# EasyEDA Pro project custom_ctrl_20250401.epro, board PCB1
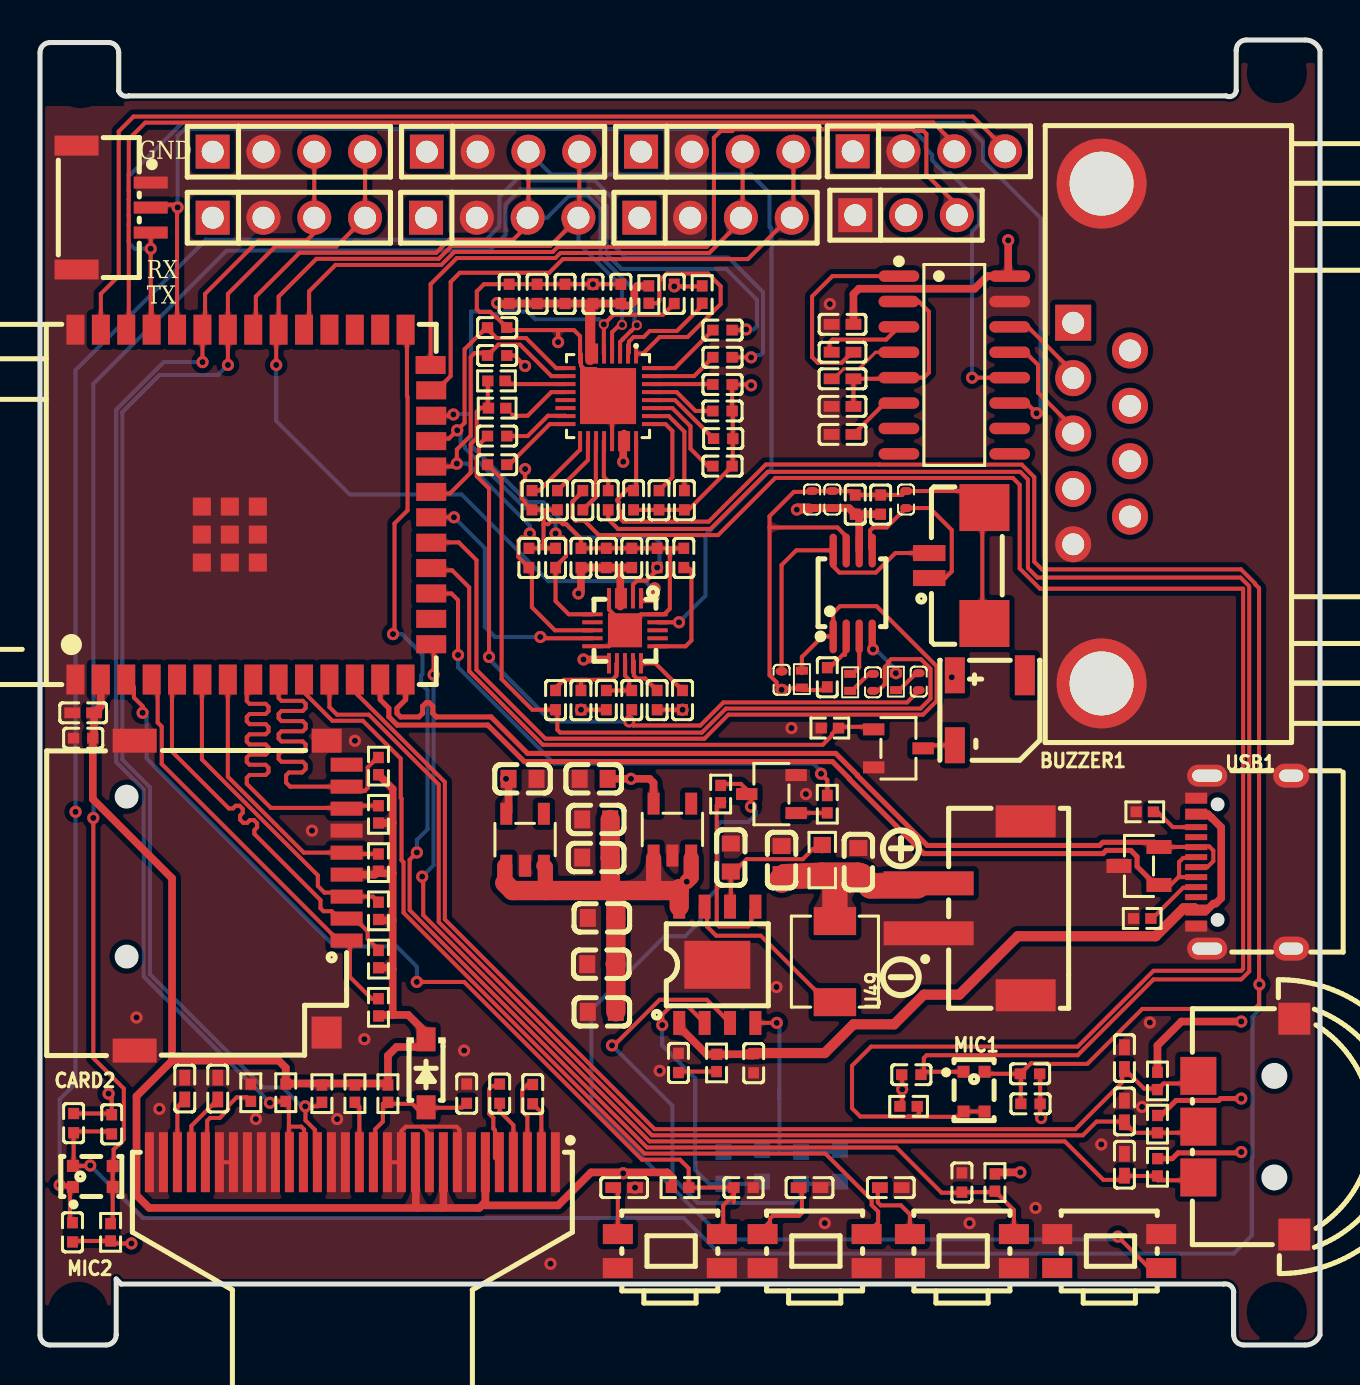
[diagram p1: board, top side]
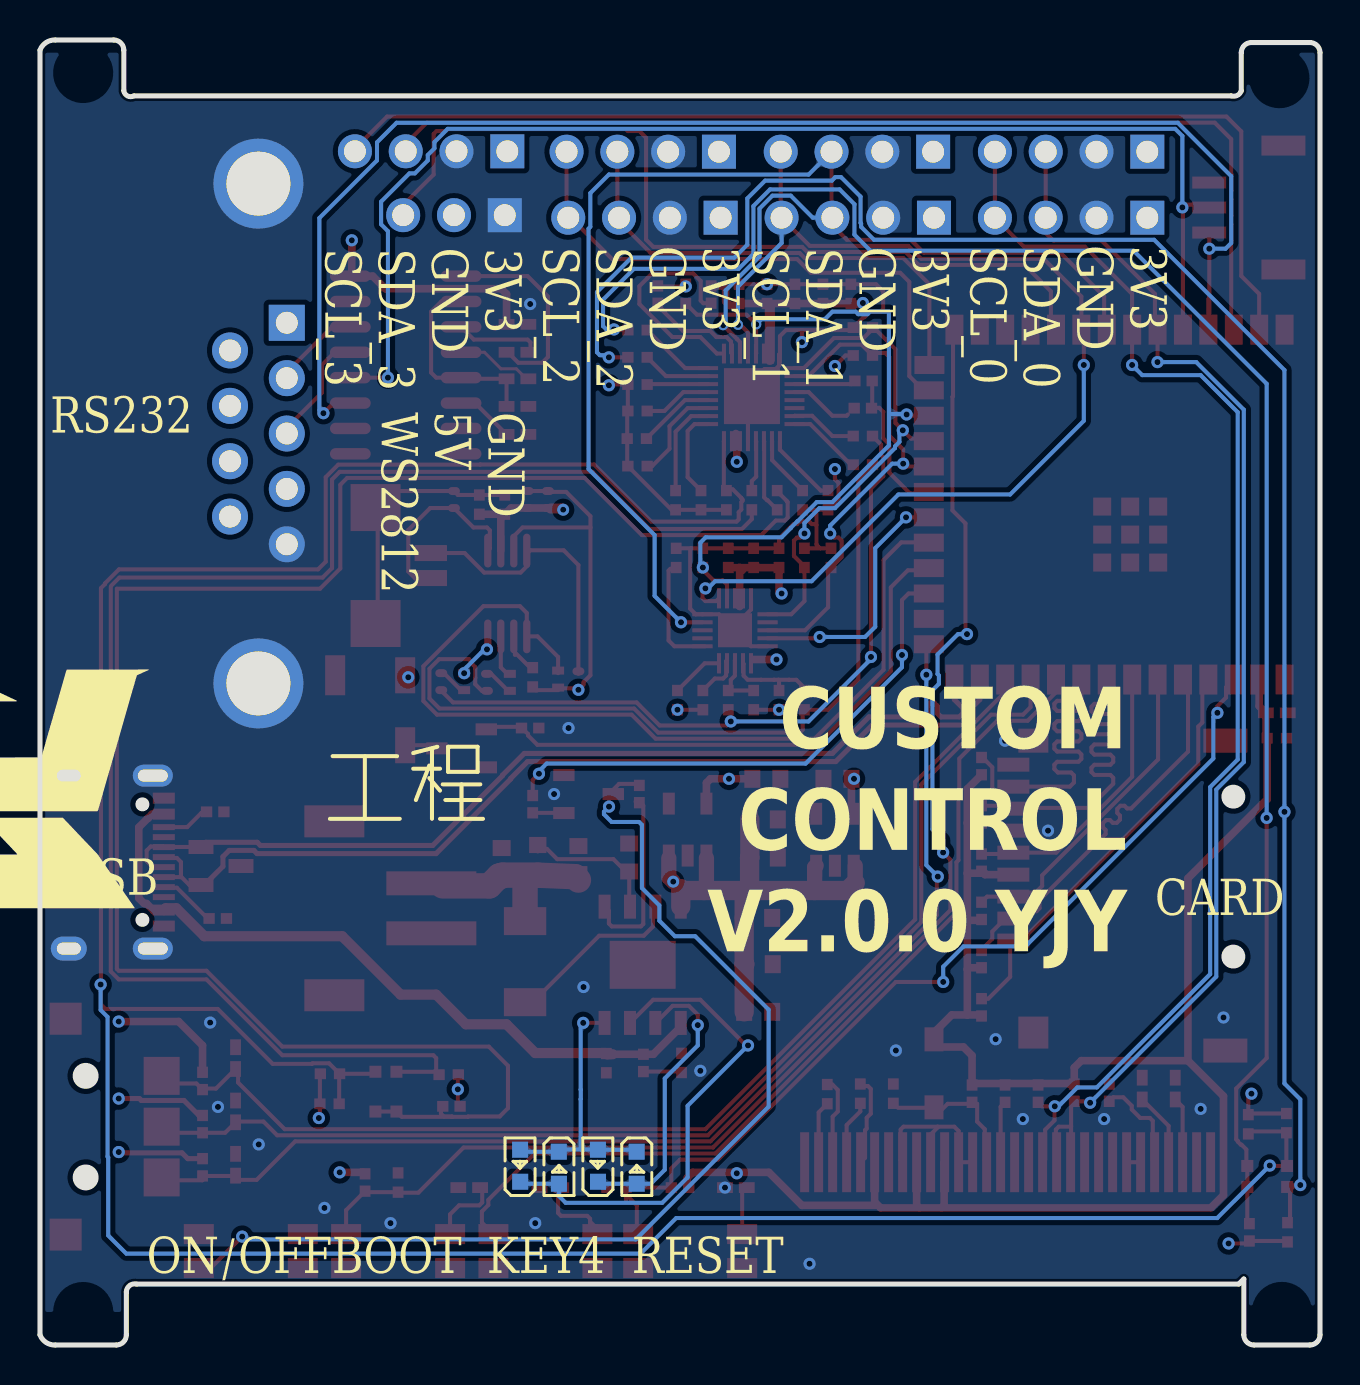
[diagram p2: board, bottom side, seen from below]

Outline 64.01 x 65.28 mm; copper layers: Top Layer, 电源层, 地层, Bottom Layer. Coordinates in mm from the lower left corner of the outline.
Outline path: 0,64.64 arc(0.15,65) 0.51,65.15 3.43,65.15 arc(3.79,65) 3.94,64.64 3.94,62.74 arc(4.14,62.51) 4.45,62.48 59.31,62.48 arc(59.63,62.48) 59.82,62.74 59.82,64.77 arc(59.97,65.13) 60.32,65.28 63.25,65.28 arc(63.71,65.15) 64.01,64.77 64.01,0.51 arc(63.71,0.13) 63.25,0 60.2,0 arc(59.84,0.15) 59.69,0.51 59.69,2.67 arc(59.53,2.98) 59.18,3.05 4.06,3.05 3.81,3.3 3.81,0.51 arc(3.66,0.15) 3.3,0 0.51,0 arc(0.15,0.15) 0,0.51 0,64.64
Stack: Top Layer 0.035mm 外层铜厚1oz / Dielectric1 0.2104mm 7628 RC49% 8.6mil / 电源层 0.0152mm 内层铜厚 / Dielectric2 1.065mm 1.1mm H/HOZ Copper / 地层 0.0152mm 内层铜厚 / Dielectric3 0.2104mm 7628 RC49% 8.6mil / Bottom Layer 0.035mm 外层铜厚1oz

## Design rules (mm)
net D-: DP1
net D+: DP1
template: 自定义配置
spacing copperThickness1oz (default): track to track 0.102, other pairs 0.152 to 0.3
spacing copperThickness2oz: track to track 0.203, other pairs 0.152 to 0.3
track width copperThickness1oz (default): min 0.127, default 0.203, max 2.54
track width copperThickness2oz: min 0.203, default 0.254, max 2.54
track width 3V3: min 0.127, default 0.381, max 2.54
track width vbus: min 0.127, default 1.27, max 2.54
track width 5V: min 0.127, default 0.965, max 2.54
differential pair differentialPair (default): width min 0.127, default 0.254, max 2.54; gap min 0.152, default 0.152
via viaSize (default): diameter min 0.5, default 0.61, max 10; hole min 0.3, default 0.305, max 6.299
net +5V uses 5V
net VBUS uses 3V3
net VBAT uses vbus
net 3V3 uses 3V3
net VDD_3V3 uses 3V3

## Placement (name value [footprint] x y rotation side)
BUZZER1  FST-5020  [BUZ-SMD_FST-5020]  47.5 31.75 270 top
C1  22uF  [C0603]  28.1 16.66 180 top
C2  22uF  [C0603]  28.07 19.05 180 top
C3  22uF  [C0603]  28.1 21.36 180 top
C4  10uF  [C0402]  35.69 14.1 90 top
C5  22uF  [C0603]  37.08 24.26 270 top
C6  22uF  [C0603]  40.92 24.16 270 top
C7  10uF  [C0402]  31.93 14.11 270 top
C8  22uF  [C0603]  34.54 24.38 270 top
C13  22uF  [C0603]  27.81 26.29 0 top
C14  22uF  [C0603]  27.69 28.32 0 top
C15  100nF  [C0402#2]  41.66 33.15 270 top
C16  1uF  [C0402]  39.37 33.4 270 top
C17  1uF  [C0402]  40.77 42.04 90 top
C18  1nF  [C0402#2]  38.61 42.29 270 top
C19  100nF  [C0402#2]  39.62 42.29 270 top
C20  10uF  [C0402]  42.04 42.04 270 top
C21  1nF  [C0402#2]  43.31 42.29 270 top
C22  1nF  [C0402#2]  37.08 33.27 270 top
C34  100nF  [C0402#3]  54.23 14.35 270 top
C35  100nF  [C0402#3]  54.23 11.68 270 top
C36  100nF  [C0402#3]  54.23 9.02 270 top
C37  1uF  [C0402]  34.16 45.34 0 top
C39  1uF  [C0402]  34.13 43.96 0 top
C40  1uF  [C0402]  32.22 42.26 270 top
C41  1uF  [C0402]  30.95 42.26 270 top
C42  1uF  [C0402]  32.19 39.37 270 top
C43  1uF  [C0402]  29.68 42.26 270 top
C44  1uF  [C0402]  32.13 32.26 90 top
C45  1uF  [C0402]  30.86 32.26 90 top
C46  1uF  [C0402]  24.64 12.55 270 top
C47  1uF  [C0402]  22.99 12.57 270 top
C48  4.7uF  [C0402#3]  7.24 12.83 270 top
C49  4.7uF  [C0402#3]  8.89 12.83 270 top
C50  10uF  [C0402]  21.34 12.57 270 top
C51  220nF  [C0402#3]  40.13 49.66 0 top
C56  10uF  [C0402]  2.16 30.35 0 top
C57  100nF  [C0402#3]  2.16 31.62 0 top
C58  1uF  [C0402]  28.41 42.26 90 top
C59  1uF  [C0402]  24.6 42.26 270 top
C60  1uF  [C0402]  25.87 42.26 270 top
C61  1uF  [C0402]  27.14 42.26 270 top
C62  22pF  [C0402]  30.86 39.37 270 top
C63  22pF  [C0402]  25.78 39.37 270 top
C64  22pF  [C0402]  24.45 39.37 270 top
C65  1uF  [C0402]  35.18 7.87 180 top
C66  1uF  [C0402]  46.1 8.13 270 top
C67  100nF  [C0402#3]  42.55 7.87 180 top
C68  100nF  [C0402#3]  29.21 7.87 180 top
C69  100nF  [C0402#3]  38.48 7.87 180 top
C78  100nF  [C0402#2]  43.94 33.18 270 top
C79  1uF  [C0402]  29.05 52.58 270 top
C80  100nF  [C0402]  26.25 52.58 270 top
C81  100nF  [C0402]  27.65 52.58 270 top
C82  22pF  [C0402]  31.72 52.58 270 top
C83  22pF  [C0402]  22.86 50.89 180 top
C84  22pF  [C0402]  22.86 49.5 180 top
C85  1uF  [C0402]  22.86 44.03 0 top
C86  1uF  [C0402]  22.86 45.47 0 top
C87  1uF  [C0402]  24.86 52.58 90 top
C88  1uF  [C0402]  23.46 52.58 90 top
C89  1uF  [C0402]  34.13 48.04 0 top
C90  1uF  [C0402]  34.13 46.72 0 top
C91  22uF  [C0603]  24.13 28.32 180 top
C92  22uF  [C0603]  27.81 24.38 0 top
C95  1uF  [C0402]  34.13 50.77 180 top
C96  1uF  [C0402]  34.13 49.41 180 top
C97  100nF  [C0402]  1.68 11.1 90 top
C98  10uF  [C0402]  3.59 11.04 270 top
C99  22pF  [C0402]  1.62 5.64 90 top
C100  22pF  [C0402]  43.57 13.52 0 top
C101  10uF  [C0402]  49.53 12.06 180 top
C102  100nF  [C0402]  49.51 13.57 0 top
C103  100nF  [C0402]  29.59 39.37 270 top
C104  100nF  [C0402]  28.32 39.37 270 top
C105  1uF  [C0402]  27.05 39.37 270 top
C106  22pF  [C0402]  27.05 32.26 90 top
C107  22pF  [C0402]  28.32 32.26 90 top
C108  1uF  [C0402]  25.78 32.26 90 top
C109  1uF  [C0402]  29.59 32.26 90 top
C113  220nF  [C0402#3]  40.13 48.33 0 top
C114  220nF  [C0402#3]  40.13 46.95 0 top
C115  220nF  [C0402#3]  40.13 45.55 0 top
C116  220nF  [C0402#3]  40.13 51.05 0 top
CARD2  TF PUSH  [TF-SMD_TF-PUSH]  10.03 22.48 270 top
D2  1N4148W  [SOD-123_L2.7-W1.6-LS3.7-RD-1]  19.3 13.59 270 top
D25  25%  [LED_0603]  34.16 8.82 270 bottom
D50  50%  [LED_0603]  36.11 9.02 90 bottom
D75  75%  [LED_0603]  38.05 8.82 270 bottom
D100  100%  [LED_0603]  40 9.02 90 bottom
FPC1  HC-1.25-2PLT  [CONN-SMD_HC-1.25-2PLT]  45.85 38.99 90 top
H1  PZ254V-11-04P  [HDR-TH_4P-P2.54-V-M]  12.45 59.69 0 top
H2  PZ254V-11-04P  [HDR-TH_4P-P2.54-V-M]  12.45 56.39 0 top
H5  PZ254V-11-03P  [HDR-TH_3P-P2.54-V-M]  43.31 56.51 0 top
H6  PZ254V-11-04P  [HDR-TH_4P-P2.54-V-M]  23.11 56.39 0 top
H7  PZ254V-11-04P  [HDR-TH_4P-P2.54-V-M]  23.16 59.69 0 top
H8  PZ254V-11-04P  [HDR-TH_4P-P2.54-V-M]  33.87 59.69 0 top
H9  PZ254V-11-04P  [HDR-TH_4P-P2.54-V-M]  33.78 56.39 0 top
H10  PZ254V-11-04P  [HDR-TH_4P-P2.54-V-M]  44.45 59.71 0 top
L1  1uH  [IND-SMD_L4.4-W4.2]  39.75 19.18 270 top
MIC1  ZTS6216  [MIC-SMD_4P-L2.8-W1.9-P1.84-TL]  46.71 12.67 0 top
MIC2  ZTS6216  [MIC-SMD_4P-L2.8-W1.9-P1.84-TL]  2.64 8.43 90 top
Q1  S8050  [SOT-23-3_L2.9-W1.6-P1.90-LS2.8-BR]  36.58 27.56 0 top
Q5  AO3400A  [SOT-23-3_L2.9-W1.6-P1.90-LS2.8-BR]  42.93 29.84 180 top
R1  2Ω  [R0402]  33.83 14.11 90 top
R2  10kΩ  [R0402]  34.04 27.56 90 top
R3  500mΩ  [R0603]  39.12 24.26 270 top
R5  1kΩ  [R0402]  39.37 27.05 270 top
R8  100kΩ  [R0402#2]  42.8 33.18 90 top
R9  100kΩ  [R0402#2]  40.51 33.15 90 top
R18  10kΩ  [R0402]  55.88 13.21 90 top
R19  10kΩ  [R0402]  55.88 11.05 90 top
R20  10kΩ  [R0402]  55.88 8.89 90 top
R26  10kΩ  [R0402]  30.45 52.54 90 top
R27  10kΩ  [R0402]  33.11 52.54 90 top
R30  620kΩ  [R0402]  10.54 12.62 270 top
R31  4.7kΩ  [R0402]  14.1 12.57 270 top
R32  4.7kΩ  [R0402]  12.29 12.62 90 top
R33  4.7kΩ  [R0402]  17.4 12.57 90 top
R34  4.7kΩ  [R0402]  15.75 12.57 90 top
R36  51Ω  [R0402]  22.83 48.23 0 top
R37  0Ω(NC)  [R0402]  22.86 46.86 0 top
R48  0Ω  [R0402]  3.53 5.64 90 top
R52  0Ω  [R0402]  43.43 11.94 0 top
R65  1kΩ  [R0402]  39.5 30.86 180 top
R72  100kΩ  [R0402#2]  38.1 33.31 90 top
R75  5.1kΩ  [R0402]  55.25 26.67 180 top
R76  5.1kΩ  [R0402]  55.12 21.34 180 top
R77  5.1kΩ  [R0402]  32 7.87 180 top
R78  5.1kΩ  [R0402]  47.75 8.13 90 top
R79  47K  [R0402]  16.93 16.89 90 top
R80  47K  [R0402]  16.93 19.3 90 top
R81  47K  [R0402]  16.93 21.72 90 top
R82  47K  [R0402]  16.93 24.13 90 top
R83  47K  [R0402]  16.93 26.54 90 top
R84  47K  [R0402]  16.93 28.96 90 top
SW2  K1-1502SA-01  [KEY-SMD_K1-1502SA-01]  60.32 10.92 270 top
SW7  TS-1085SA-B3  [KEY-SMD_4P-L4.8-W4.6-P1.70-LS6.2-1]  46.1 4.7 0 top
SW8  TS-1085SA-B3  [KEY-SMD_4P-L4.8-W4.6-P1.70-LS6.2-1]  31.5 4.7 0 top
SW9  TS-1085SA-B3  [KEY-SMD_4P-L4.8-W4.6-P1.70-LS6.2-1]  38.74 4.7 0 top
SW11  TS-1085SA-B3  [KEY-SMD_4P-L4.8-W4.6-P1.70-LS6.2-1]  53.47 4.7 0 top
U1  IP5306  [ESOP-8_L4.9-W3.9-P1.27-LS6.0-BL-EP]  33.87 19.02 0 top
U2  ESP32-S3-WROOM-1-N16R8  [WIRELM-SMD_ESP32-S3-WROOM-1]  10.67 42.04 90 top
U3  NS4150B  [MSOP-8_L3.0-W3.0-P0.65-LS5.0-BL]  40.64 37.59 0 top
U5  MAX3232ESE(UMW)  [SOP-16_L9.9-W3.9-P1.27-LS6.0-BL]  45.72 49.02 270 top
U6  OLED128O064AGAP3N00000  [tft-smd_oled128o064agap3n00000]  15.62 9.14 180 top
U9  ES8311  [WQFN-20_L3.0-W3.0-P0.40-BL-EP1.7]  29.25 35.75 180 top
U10  RT9013-3.3GB  [SOT-23-5_L2.9-W1.6-P0.94-LS2.8-BL]  31.62 25.78 0 top
U43  PSM712-ES  [SOT-23-3_L2.9-W1.3-P1.90-LS2.4-BR]  54.96 23.96 0 top
U44  D-SUB-DR-9PCM-CB  [DB9-TH_D-SUB-DR-9PCM-CB]  53.09 45.59 90 top
U46  ES7210  [QFN-32_L4.0-W4.0-P0.40-BL-EP2.7]  28.41 47.47 180 top
U47  RT9013-3.3GB  [SOT-23-5_L2.9-W1.6-P0.94-LS2.8-BL]  24.26 25.27 0 top
U48  SM03B-GHS-TB(LF)(SN)  [CONN-TH_SM03B-GHS-TB-LF-SN]  3.68 56.9 270 top
U49  ZX-XH2.54-2PLT  [CONN-SMD_2P-P2.50_HCTL_HC-XH-2ALT]  46.86 21.84 90 top
USB1  TYPE-C 16PIN 2MD(073)  [USB-C-SMD_TYPE-C-6PIN-2MD-073]  60.19 24.15 90 top

## Footprints (pads in the part's own frame, mm; a bottom-side part is the same pattern mirrored in y, then rotated)
BUZ-SMD_FST-5020
  rect 1.8x1 smd: 1(-1.75,-1.75) 2(1.75,-1.75)
  rect 2x1 smd: 3(-1.75,1.75)
C0402
  rect 0.566x0.54 smd: 1(-0.481,0) 2(0.481,0)
C0402#3
  rect 0.79x0.54 smd: 1(-0.545,0) 2(0.545,0)
C0402#2
  rrect 0.4x0.6 smd: 1(-0.425,0) 2(0.425,0)
C0603
  rect 0.8x0.9 smd: 1(-0.7,0) 2(0.7,0)
CONN-SMD_2P-P2.50_HCTL_HC-XH-2ALT
  rect 1.2x4.5 smd: 1(-1.25,2.425) 2(1.25,2.425)
  rect 1.6x3 smd: 3(4.35,-2.425) 4(-4.35,-2.425)
CONN-SMD_HC-1.25-2PLT
  rect 0.8x1.62 smd: 1(-0.625,1.38) 2(0.625,1.38)
  rect 2.35x2.5 smd: 3(2.9,-1.38) 4(-2.9,-1.38)
CONN-TH_SM03B-GHS-TB-LF-SN
  rect 0.6x1.7 smd: 1(-1.25,1.854) 2(0,1.854) 3(1.25,1.854)
  rect 1x2.2 smd: 4(3.1,-1.854) 5(-3.1,-1.854)
DB9-TH_D-SUB-DR-9PCM-CB
  rect 1.8x1.8 hole 1.1: 1(5.54,1.42)
  round 1.8 hole 1.1: 2(2.77,1.42) 3(0,1.42) 4(-2.77,1.42) 5(-5.54,1.42) 6(4.155,-1.42) 7(1.385,-1.42) 8(-1.385,-1.42) 9(-4.155,-1.42)
  round 4.5 hole 3.2: 10(-12.5,0) 11(12.5,0)
ESOP-8_L4.9-W3.9-P1.27-LS6.0-BL-EP
  rect 0.6x1.2 smd: 1(-1.905,-2.909) 2(-0.635,-2.909) 3(0.635,-2.909) 4(1.905,-2.909) 5(1.905,2.909) 6(0.635,2.909) 7(-0.635,2.909) 8(-1.905,2.909)
  rect 3.3x2.4 smd: 9(0,0)
HDR-TH_3P-P2.54-V-M
  rect 1.7x1.7 hole 1.1: 1(-2.54,0)
  round 1.7 hole 1.1: 2(0,0) 3(2.54,0)
HDR-TH_4P-P2.54-V-M
  rect 1.7x1.7 hole 1.1: 1(-3.81,0)
  round 1.7 hole 1.1: 2(-1.27,0) 3(1.27,0) 4(3.81,0)
IND-SMD_L4.4-W4.2
  rect 1.4x2.12 smd: 1(2.028,0) 2(-2.028,0)
KEY-SMD_4P-L4.8-W4.6-P1.70-LS6.2-1
  rect 1.5x1 smd: 1(-2.6,0.85) 2(2.6,0.85) 3(-2.6,-0.85) 4(2.6,-0.85)
KEY-SMD_K1-1502SA-01
  rect 1.9x1.8 smd: 1(-2.54,-2.4) 2(2.54,-2.4) T(0,-2.4)
  rect 1.6x1.6 smd: 5(-5.4,2.4) C(5.4,2.4)
LED_0603
  rect 0.8x0.8 smd: 1(-0.851,-0.01) 2(0.75,-0.005)
MIC-SMD_4P-L2.8-W1.9-P1.84-TL
  rect 0.6x0.6 smd: 1(-0.525,0.995) 2(-0.525,-0.995) 3(0.525,-0.995) 4(0.525,0.995)
MSOP-8_L3.0-W3.0-P0.65-LS5.0-BL
  oval 0.364x1.692 smd: 1(-0.975,-2.146) 2(-0.325,-2.146) 3(0.325,-2.146) 4(0.975,-2.146) 5(0.975,2.146) 6(0.325,2.146) 7(-0.325,2.146) 8(-0.975,2.146)
QFN-32_L4.0-W4.0-P0.40-BL-EP2.7
  rect 0.2x0.991 smd: 1(-1.4,-2.127)
  rect 0.2x1.001 smd: 2(-1,-2.127) 3(-0.6,-2.127) 4(-0.2,-2.127) 5(0.2,-2.127) 6(0.6,-2.127) 7(1,-2.127) 8(1.4,-2.127) 17(1.4,2.255) 18(1,2.255) 19(0.6,2.255) 20(0.2,2.255) 21(-0.2,2.255) 22(-0.6,2.255) 23(-1,2.255) 24(-1.4,2.255)
  rect 1.001x0.2 smd: 9(2.128,-1.4) 10(2.128,-1) 11(2.128,-0.6) 12(2.128,-0.2) 13(2.128,0.2) 14(2.128,0.6) 15(2.128,1) 16(2.128,1.4)
  rect 1x0.2 smd: 25(-2.196,1.4) 26(-2.196,1) 27(-2.196,0.6) 28(-2.196,0.2) 29(-2.196,-0.2) 30(-2.196,-0.6) 31(-2.196,-1) 32(-2.196,-1.4)
  rect 2.8x2.8 smd: 33(0,0)
R0402
  rect 0.566x0.54 smd: 1(-0.433,0) 2(0.433,0)
R0402#2
  rect 0.4x0.6 smd: 1(-0.425,0) 2(0.425,0)
R0603
  rect 0.806x0.864 smd: 1(-0.753,0) 2(0.753,0)
SOD-123_L2.7-W1.6-LS3.7-RD-1
  rect 1.2x0.95 smd: 1(-1.7,0) 2(1.7,0)
SOP-16_L9.9-W3.9-P1.27-LS6.0-BL
  oval 0.574x2.038 smd: 1(-4.445,-2.769) 2(-3.175,-2.769) 3(-1.905,-2.769) 4(-0.635,-2.769) 5(0.635,-2.769) 6(1.905,-2.769) 7(3.175,-2.769) 8(4.445,-2.769) 9(4.445,2.769) 10(3.175,2.769) 11(1.905,2.769) 12(0.635,2.769) 13(-0.635,2.769) 14(-1.905,2.769) 15(-3.175,2.769) 16(-4.445,2.769)
SOT-23-3_L2.9-W1.3-P1.90-LS2.4-BR
  rect 1.25x0.7 smd: 1(1,-0.95) 2(1,0.95) 3(-1,0)
SOT-23-3_L2.9-W1.6-P1.90-LS2.8-BR
  rect 1.07x0.6 smd: 1(1.235,-0.95) 2(1.235,0.95) 3(-1.235,0)
SOT-23-5_L2.9-W1.6-P0.94-LS2.8-BL
  rect 0.6x1.1 smd: 1(-0.94,-1.3) 2(0,-1.3) 3(0.94,-1.3) 4(0.94,1.3) 5(-0.94,1.3)
TF-SMD_TF-PUSH
  rect 0.7x1.6 smd: 1(2.25,5.3) 2(1.15,5.3) 3(0.05,5.3) 4(-1.05,5.3) 5(-2.15,5.3) 6(-3.25,5.3) 7(-4.35,5.3) 8(-5.45,5.3) CD(-6.55,5.3)
  rect 1.2x1.5 smd: 10(-7.75,4.3)
  rect 1.2x2.2 smd: 11(-7.75,-5.3) 12(7.75,-5.3)
  rect 1.6x1.5 smd: 13(6.85,4.3)
tft-smd_oled128o064agap3n00000
  rect 0.45x3 smd: 1(-10.15,0) 2(-9.45,0) 3(-8.75,0) 4(-8.05,0) 5(-7.35,0) 6(-6.65,0) 7(-5.95,0) 8(-5.25,0) 9(-4.55,0) 10(-3.85,0) 11(-3.15,0) 12(-2.45,0) 13(-1.75,0) 14(-1.05,0) 15(-0.35,0) 16(0.35,0) 17(1.05,0) 18(1.75,0) 19(2.45,0) 20(3.15,0) 21(3.85,0) 22(4.55,0) 23(5.25,0) 24(5.95,0) 25(6.65,0) 26(7.35,0) 27(8.05,0) 28(8.75,0) 29(9.45,0) 30(10.15,0)
USB-C-SMD_TYPE-C-6PIN-2MD-073
  rect 0.55x1.1 smd: 1(-3.2,2.375) 2(-2.4,2.375) 11(2.4,2.375) 12(3.2,2.375)
  rect 0.3x1.1 smd: 3(-1.75,2.375) 4(-1.25,2.375) 5(-0.75,2.375) 6(-0.25,2.375) 7(0.25,2.375) 8(0.75,2.375) 9(1.25,2.375) 10(1.75,2.375)
  oval 1.1x2 hole 0.6x1.5: 13(-4.325,1.825) 14(4.325,1.825)
  oval 1.2x1.8 hole 0.6x1.2: 13(-4.325,-2.375) 14(4.325,-2.375)
WIRELM-SMD_ESP32-S3-WROOM-1
  rect 1.5x0.9 smd: 1(-8.75,8.895) 2(-8.75,7.625) 3(-8.75,6.355) 4(-8.75,5.085) 5(-8.75,3.815) 6(-8.75,2.545) 7(-8.75,1.275) 8(-8.75,0.005) 9(-8.75,-1.265) 10(-8.75,-2.535) 11(-8.75,-3.805) 12(-8.75,-5.075) 13(-8.75,-6.345) 14(-8.75,-7.615) 27(8.75,-7.615) 28(8.75,-6.345) 29(8.75,-5.075) 30(8.75,-3.805) 31(8.75,-2.535) 32(8.75,-1.265) 33(8.75,0.005) 34(8.75,1.275) 35(8.75,2.545) 36(8.75,3.815) 37(8.75,5.085) 38(8.75,6.355) 39(8.75,7.625) 40(8.75,8.895)
  rect 0.9x1.5 smd: 15(-6.985,-8.895) 16(-5.715,-8.895) 17(-4.445,-8.895) 18(-3.175,-8.895) 19(-1.905,-8.895) 20(-0.635,-8.895) 21(0.635,-8.895) 22(1.905,-8.895) 23(3.175,-8.895) 24(4.445,-8.895) 25(5.715,-8.895) 26(6.985,-8.865)
  rect 0.9x0.9 smd: 41(-2.9,2.575) 41(-2.9,1.175) 41(-2.9,-0.225) 41(-1.5,2.575) 41(-1.5,1.175) 41(-1.5,-0.225) 41(-0.1,2.575) 41(-0.1,1.175) 41(-0.1,-0.225)
WQFN-20_L3.0-W3.0-P0.40-BL-EP1.7
  rect 0.2x1.016 smd: 1(-0.8,-1.602) 2(-0.4,-1.602) 3(0,-1.602) 4(0.4,-1.602) 5(0.8,-1.602) 11(0.8,1.651) 12(0.4,1.651) 13(0,1.651) 14(-0.4,1.651) 15(-0.8,1.651)
  rect 1.016x0.2 smd: 6(1.628,-0.8) 7(1.628,-0.4) 8(1.628,0) 9(1.628,0.4) 10(1.628,0.799) 16(-1.628,0.8) 17(-1.628,0.4) 18(-1.628,0) 19(-1.628,-0.4) 20(-1.628,-0.8)
  rect 1.7x1.7 smd: 21(0,0)

## Nets
As in the schematic.

Pads without a net: BUZZER1 3; CARD2 CD; SW11 3; U2 16 28 29 30; U5 7 8 9 10; U9 7 17 18; U10 4; U44 1 4 6 7 8 9; U46 13 14; U47 4; USB1 3 9

## Via types
v1: diameter 0.61, hole 0.305, Top Layer to Bottom Layer, 90 vias
v2: diameter 0.508, hole 0.305, Top Layer to Bottom Layer, 3 vias
v3: diameter 0.6, hole 0.3, Top Layer to Bottom Layer, 2 vias

## Routing (per net, layer and track width the routed paths; a pad name or vN(x,y) marks a point on that pad's centre or on a via; arc(x,y) is an arc through that point)
3V3: length 325.6
  Top Layer w0.254: R20.2 56.62,9.32 56.91,9.61 60.03,9.61 v1(60.07,9.65) ; R19.2 56.06,11.48 56.81,12.23 58.94,12.23 59.04,12.33 v1(60.07,12.33)
  Top Layer w0.381: 17.64,26.11 17.64,23.6 ; 17.64,26.11 17.64,27.81 R84.1 ; 17.64,26.11 16.93,26.11 R83.1 ; 17.64,23.6 17.02,23.6 ; 17.64,23.6 17.64,21.24 ; 18.92,6.86 5.46,6.86 4.83,7.49 4.83,12.45 6.6,14.22 ; 18.92,6.86 18.8,6.98 18.8,9.12 U6.11 ; 18.92,6.86 20.04,6.86 ; R80.1 17.56,18.87 17.64,18.79 ; 17.64,18.79 17.64,16.51 ; 17.64,18.79 17.64,21.24 ; 17.64,16.51 18.41,16.51 19.18,15.75 19.18,15.16 19.43,14.91 17.83,14.91 17.4,14.48 17.4,13.08 12.57,13.08 12.54,13.05 R32.2 12.29,13.87 11.94,14.22 6.6,14.22 ; 17.64,16.51 16.98,16.51 R79.1 ; 16.83,23.6 16.76,23.53 CARD2.4 ; 16.83,23.6 16.76,23.6 ; 16.83,23.6 17.02,23.6 ; 16.83,23.6 R82.1 17.02,23.6 ; 6.6,14.22 6.6,23.34 2.64,27.31 C56.2 2.7,30.42 C57.2 3.04,31.96 U2.2 ; 20.04,6.86 20.17,6.98 U6.9 ; 20.04,6.86 21.97,6.86 22.27,7.16 U6.6 ; 28.45,28.32 v1(29.55,28.32) 30.48,28.32 30.68,28.12 U10.5 ; v1(49.02,8.64) 47.83,8.64 R78.2 ; v1(60.07,16.18) 57.07,16.18 55.88,14.99 R18.2 ; v1(48.42,55.26) 48.42,53.54 U5.16 47.37,53.47 46.74,52.84 40.95,52.84 40.68,52.57 C116.2 ; 17.64,21.24 16.97,21.24 R81.1 ; R77.2 31.64,7.94 31.64,8.37 31.37,8.64 27.56,8.64 25.91,6.98 22.22,6.98
  电源层 w0.381: H1.1 8.76,59.56 ; v1(29.16,8.59) 29.21,8.64 v1(49.02,8.64)
  电源层 w0.508: H6.1 19.35,56.43 19.35,58.37 30.06,58.37 ; 30.06,58.37 30.26,58.17 39.5,58.17 ; 30.06,58.37 30.06,59.56 ; 30.06,58.37 30.06,56.35 29.97,56.26 ; 40.64,58.17 43.43,58.17 44.56,57.04 44.56,56.67 44.59,56.64 44.59,55.99 45.33,55.26 v1(48.42,55.26) 54.98,55.26 60.12,50.12 60.12,37.63 ; 40.64,58.17 40.64,59.58 ; 40.64,58.17 39.5,58.17 ; 39.5,58.17 39.51,58.15 39.51,56.15 37.01,53.64 37.01,42.98 34.42,40.39 34.42,29.59 33.15,28.32 29.46,28.32 ; H1.1 8.64,58.36 ; 8.64,58.36 8.65,58.37 19.35,58.37 H7.1 ; 8.64,58.36 H2.1 ; v1(49.02,8.64) 49.78,8.64 51.18,7.24 59.44,7.24 60.12,7.92 60.12,37.63 ; 60.12,37.63 50.84,37.63 49.53,36.32 49.53,34.04 48.9,33.4 v1(45.59,33.4)
+5V: length 69.4
  Top Layer w0.381: C20.2 C17.1 ; C17.1 40.97,41.36 U3.6 ; C17.1 40.46,41.87 C19.2 C18.2
  Top Layer w0.508: 38.47,41.84 37.9,41.84 v3(37.85,41.78)
  Top Layer w0.762: 25.27,22.73 25.27,23.9 U47.3 ; 30.68,24.35 30.68,22.86 30.81,22.73 ; v3(32.34,23.18) 32.56,23.4 32.56,24.35 ; 23.24,23.11 23.24,23.97
  Top Layer w0.965: U1.8 31.97,22.82 31.88,22.73 28.52,22.73 ; 28.52,22.73 28.8,22.46 C3.1 28.8,19.08 C2.1 28.8,19.02 C1.1 ; 28.52,22.73 28.52,24.37 C92.2 C13.2 ; 28.52,22.73 23.62,22.73 23.24,23.11
  电源层 w0.965: v3(32.34,23.18) 32.34,23.68 33.4,24.74 33.4,26.11 36.07,28.77 36.07,40 v3(37.85,41.78) 38.1,42.04 38.1,52.61 39.97,54.48 41.33,54.48 43.31,56.46 H5.2
GND: length 9.6
  Top Layer w0.203: 19.12,10.92 18.29,10.92 18.07,10.7 U6.12 U6.13 ; 19.12,10.92 20.83,10.92 20.97,10.78 20.97,9.24 U6.8 ; 19.12,10.92 19.1,10.9 19.47,10.53 U6.10 ; U6.25 U6.24
  vias: v1(4.83,16.38) v1(5.97,11.81) v1(10.8,11.3) v1(13.6,25.73) v1(14.86,11.3) v1(15.75,30.23) v1(16.22,15.3) v1(21.21,14.73) v1(25.53,4.06) v1(29.75,7.87) v1(30.99,13.72) v1(36.83,17.91) v1(37.58,30.86) v1(38.3,27.56) v1(39.24,6.1) v1(39.5,52.07) v1(46.48,6.1) v1(49.78,6.86) v1(53.07,10.03) v1(55.11,11.91) v1(55.5,16.13)
VBAT: length 9.1
  Top Layer w1.27: 39.12,23.5 37.25,23.43 37.08,23.26 ; 43.87,22.97 41.54,22.97 41.05,23.46 C6.2 40.88,23.5 R3.2 ; 39.75,23.24 L1.2
VBUS: length 36.4
  Top Layer w0.381: 32.02,15.73 31.97,15.73 ; 31.9,16.24 31.9,15.98 33.34,14.54 R1.2 35.37,14.54 ; 57.85,21.72 58.31,21.72 58.68,22.08 58.8,22.08 59.07,22.35 59.07,25.9 58.61,26.35 58.6,26.35 58.4,26.55 USB1.11
  Top Layer w0.508: 35.37,14.54 35.65,14.54 C4.2 35.71,14.6 39.24,14.6 40.68,16.04 42.71,16.04 44.2,17.53 45.97,17.53 48.9,20.45 55.79,20.45 57.19,21.85 57.72,21.85 USB1.2
VDD_3V3: length 63.2
  Top Layer w0.381: 29.03,38.89 C104.2 C105.2 27.05,37.72 v1(26.92,37.59) ; 29.03,38.89 28.89,38.75 ; 29.03,38.89 C103.2 ; U47.5 23.43,26.69 C91.2 ; v1(29.16,44.18) 29.16,45.55 29.21,45.59 ; 28.94,37.02 29.02,36.94 29.02,38.75 ; 28.32,34.29 v1(27.18,34.29) ; R26.2 29.86,52.98 29.72,52.83 29.72,52.2 29.51,52 29.12,52 29.05,52.07 C79.2 C81.2 C80.2 C87.1 C88.1 23.43,52.07 22.91,52.07 v1(22.86,52.12)
  Top Layer w0.508: C81.2 27.51,51.96 27.51,49.28
  电源层 w0.508: v1(23.3,28.32) 23.3,34.27 ; 23.3,34.27 23.56,34.27 23.58,34.29 v1(27.18,34.29) ; 23.3,34.27 23.3,37.49 23.4,37.59 ; v1(22.86,52.12) 22.48,51.74 22.48,41.3 ; 22.48,41.3 22.48,37.85 22.73,37.59 23.4,37.59 ; 22.48,41.3 28.73,41.3 29.16,41.74 v1(29.16,44.18) ; 23.4,37.59 v1(26.92,37.59)
ADC_MICBIAS12: length 157.9
  Top Layer w0.203: 49.03,13.57 49.05,13.55 C101.2 ; 49.03,13.57 47.33,13.57 MIC1.4 ; 49.03,13.57 49.55,14.09 50.38,14.09 50.41,14.06 52.37,14.06 55.12,16.81 60.73,16.81 60.96,17.04 60.96,17.98 ; v1(60.98,18.03) 60.98,18 60.96,17.98 ; 60.96,17.98 60.96,37.86 60.76,38.06 60.76,38.1 60.06,38.8 50.1,38.8 49.72,39.18 49.72,43.41 49.09,44.04 42,44.04 41.99,44.04 36.3,44.04 33.44,41.19 29.18,41.19 29.07,41.29 29.07,41.66 28.94,41.79 28.94,42.16 28.87,42.23 28.87,42.29 28.94,42.35 28.94,42.37 29.37,42.8 29.62,42.8 C43.1 29.81,42.87 29.81,45.21 U46.24 ; 3.59,10.69 1.75,10.69 C97.1 1.68,8.99 MIC2.4 2.49,8.96 v1(2.51,8.98)
  Bottom Layer w0.203: v1(60.98,18.03) 60.98,16.76 60.63,16.41 60.63,9.42 60.6,9.39 60.6,5.48 59.69,4.57 33.97,4.57 32.19,6.35 5.14,6.35 v1(2.51,8.98)
AU_GND: length 210.2
  Top Layer w0.203: v1(50.06,11.35) 50.01,11.41 C101.1 50.01,13.55 C102.2 ; C42.1 31.46,39.85 ; 31.46,39.85 31.5,39.81 31.5,36.83 31.22,36.55 30.05,36.55 29.25,35.75 ; 31.46,39.85 C62.1 C103.1 C104.1 C105.1 27.05,40.34 26.33,41.06 26.15,41.06 26.01,41.2 25.55,41.2 25.41,41.06 25.21,41.06 25.18,41.03 25.18,41.78 ; v1(32.13,31.78) C45.1 ; U9.5 28.45,36.79 29.25,35.99 29.25,35.75 ; 36.48,40.89 36.48,41.46 37.7,42.67 38.44,42.67 38.48,42.72 C18.1 C19.1 40.57,42.72 C17.2 C20.1 43.11,42.52 C21.1 46.59,42.72 47.12,42.19 47.12,35.79 ; 36.48,40.89 39.88,40.89 40.31,40.46 U3.7 ; 36.48,40.89 36.48,33.5 36.83,33.15 36.83,33.03 v1(37.08,32.77) ; R27.2 33.09,52.95 v1(31.72,52.95) ; C83.1 22.82,51.41 22.78,51.41 22.52,51.67 21.99,51.67 21.84,51.82 21.84,52.7 22.2,53.06 C88.2 C87.2 C80.1 v1(27.65,53.06) C79.1 ; 23.34,50.77 25.91,50.77 ; 25.91,50.77 v1(25.91,50.16) ; 25.91,50.77 26.7,50.77 27.01,50.46 U46.8 27.05,49.55 27.05,48.99 27.22,48.82 27.78,48.82 28.41,48.19 U46.33 28.61,47.27 U46.21 ; v1(35.56,48.01) 35.52,48.04 C89.2 C90.2 34.64,46.69 C37.2 34.64,44 C39.2 32.42,41.78 C40.2 C41.2 C43.2 ; 29.25,35.75 28.45,34.95 27.62,34.95 ; 25,39.85 C64.1 ; 25,39.85 C63.1 ; 25,39.85 25.18,40.03 25.18,40.99 ; 25.18,41.78 C59.2 24.26,42.12 24.26,42.17 24.08,42.35 24.08,43.13 24.26,43.3 v1(24.26,43.81) ; 25.18,41.78 C60.2 ; v1(24.26,48.97) 23.73,49.5 C84.1 ; C22.2 38.06,32.85 R72.1 ; C97.2 3.53,11.58 C98.1 3.59,12.42 v1(3.43,12.57) ; v1(27.05,31.78) C107.1 ; v1(4.57,5.08) 3.65,5.08 R48.1 1.67,5.2 C99.1 ; 38.1,32.76 39.21,32.76 C16.2 ; R52.1 43.11,12.05 v1(43.11,12.79) 43.11,13.5 C100.1
  地层 w0.203: v1(3.43,12.57) 3.43,34.42 3.57,34.56 20.07,34.56 20.77,33.86 22.28,33.86 25.02,31.11 26.39,31.11 v1(27.05,31.78) v1(32.13,31.78) 32.36,32 36.31,32 v1(37.08,32.77) 50.06,19.79 v1(50.06,11.35) ; v1(24.26,43.81) v1(24.26,48.97) 25.45,50.16 v1(25.91,50.16) ; v1(27.65,53.06) 27.76,52.95 v1(31.72,52.95) 35.31,52.95 36.19,52.07 36.19,48.64 v1(35.56,48.01)
BOOT: length 68.6
  Top Layer w0.203: v1(18.85,24.64) 18.48,24.28 18.48,21.75 30.35,9.88 42.82,9.88 45.09,7.62 46.07,7.62 C66.2 47.7,7.65 R78.1 48.7,6.75 SW7.2 ; U2.27 18.16,50.66 18.16,50.56 18.35,50.36 18.35,47.46 18.38,47.43 18.38,41.75 17.73,41.1 17.73,35.64 v1(17.65,35.56)
  Bottom Layer w0.203: v1(18.85,24.64) 18.85,25.27 19.38,25.8 19.38,32.75 19.06,33.07 19.06,33.49 19.13,33.56 19.13,34.54 18.1,35.56 v1(17.65,35.56)
BUZZER: length 28.7
  Top Layer w0.203: U2.18 19.67,38.75 20.61,38.75 21.46,37.9 21.46,33.71 25.15,30.02 39.14,30.02 39.6,30.49 39.6,30.56 39.85,30.81 39.85,30.86 39.91,30.92 41.56,30.92 41.69,30.79
CHIP_EN: length 46.2
  Top Layer w0.203: v1(5.13,31.62) 5.13,31.95 4.7,32.38 4.7,32.9 U2.3 ; 34.7,7.52 34.7,7.14 ; 34.7,7.52 34.16,6.98 34.16,6 34.1,5.93 ; 34.7,7.52 C65.2 R77.1 32.44,8.84 32,9.27 30.1,9.27 21.21,18.16 v1(18.84,18.16)
  Bottom Layer w0.203: v1(5.13,31.62) 5.33,31.42 5.33,29.34 14.73,19.94 17.83,19.94 18.84,18.92 v1(18.84,18.16)
CTRL: length 45.6
  Top Layer w0.203: 38.1,33.61 38.1,34.42 39.13,35.45 39.66,35.45 39.66,36.62 40,36.96 41.83,36.96 44.84,33.95 44.84,32.21 44.16,31.53 34.43,31.53 33.22,30.33 25.27,30.33 21.83,33.77 21.83,39.26 20.94,40.15 19.58,40.15 U2.19
D+: length 48.2
  Top Layer w0.203: U43.2 57.81,24.91 USB1.8 57.85,24.94 58.47,24.94 58.67,24.73 58.67,24.2 58.38,23.9 USB1.6
  Top Layer w0.254: U43.2 55.72,25.15 53.15,25.15 52.99,24.99 44.37,24.99 40.88,28.48 40.88,28.51 39.79,29.59 24.38,29.59 22.56,31.42 19.82,31.42 19.64,31.6 19.64,31.95 19.46,32.13 19.31,32.13 19.13,31.95 19.13,31.6 18.95,31.42 18.03,31.42 17.85,31.6 17.85,31.85 18.28,32.28 U2.14
D-: length 48.2
  Top Layer w0.203: USB1.5 56.99,23.4 ; 56.99,23.4 56.96,23.43 56.96,24.16 57.16,24.36 57.78,24.36 USB1.7 ; 56.99,23.4 56.93,23.4 56.54,23.01 U43.1
  Top Layer w0.254: U2.13 17.01,32.28 17.44,31.85 17.44,31.43 17.86,31.01 22.39,31.01 24.22,29.18 39.62,29.18 40.47,28.34 40.47,28.31 44.2,24.58 53.16,24.58 53.31,24.74 54.55,24.74 54.86,24.43 54.86,23.94 55.79,23.01 U43.1
I2S_BCK: length 25.8
  Top Layer w0.203: 22.32,50.77 22.19,50.77 21.23,49.81 21.23,46.12 v1(20.86,45.75) 20.45,45.34 19.69,45.34 U2.23 ; 22.32,50.77 22.41,50.86 ; 22.32,50.77 22.43,50.77 22.83,50.37 24.31,50.37 25.81,48.87 U46.9 ; 27.62,36.55 26.44,36.55 25.78,37.21 C63.2 25.78,38.94 26.31,39.46 26.31,40.24 26.16,40.39 25.98,40.39 v1(25.78,40.59)
  Bottom Layer w0.203: v1(25.78,40.59) 25.78,41.11 25.04,41.86 24.26,41.86 21.25,44.86 21.25,44.95 21.03,45.17 21.03,45.59 v1(20.86,45.75)
I2S_DI: length 7.6
  Top Layer w0.203: 22.41,46.88 22.39,46.9 R36.1 ; 22.41,46.88 R37.1 ; 22.41,46.88 22.04,46.88 21.84,46.68 21.84,45.36 21.54,45.06 21.54,43.63 20.5,42.6 19.64,42.6 U2.21
I2S_DO: length 12.9
  Top Layer w0.203: 27.62,35.35 25.08,35.35 v1(25.02,35.42) ; U2.20 v1(20.7,41.4)
  Bottom Layer w0.203: v1(20.7,41.4) 22.24,39.86 22.24,35.92 22.75,35.42 v1(25.02,35.42)
I2S_MCK: length 36.2
  Top Layer w0.203: U46.5 28.19,49.6 v2(28.19,51.05) 28.68,51.54 31.16,51.54 C82.2 ; 29.65,37.35 29.65,38.03 29.87,38.25 29.87,38.24 30.34,38.24 30.86,38.77 C62.2 ; U2.24 20.61,46.48 v1(20.67,46.55)
  Bottom Layer w0.203: 21.52,46.57 21.56,46.53 21.56,44.99 24.38,42.16 25.16,42.16 26.13,41.2 26.14,41.2 26.47,40.87 26.47,40.86 26.92,40.4 30.72,40.4 30.99,40.13 30.99,39.02 v1(30.86,38.89) ; 21.52,46.57 20.7,46.57 v1(20.67,46.55) ; 21.52,46.57 21.56,46.6 21.56,51.69 22.5,51.69 22.63,51.56 23.09,51.56 23.22,51.69 24.38,51.69 24.77,51.31 27.94,51.31 v2(28.19,51.05)
I2S_WS: length 26
  Top Layer w0.203: v1(24.49,40.59) 24.29,40.39 24.07,40.39 23.92,40.24 23.92,39.41 C64.2 24.6,38.74 24.6,36.9 25.75,35.75 27.62,35.75 ; 22.49,49.61 22.43,49.61 22.38,49.56 C84.2 ; 22.49,49.61 22.49,49.62 21.74,49.62 21.54,49.42 21.54,45.49 20.84,44.79 v1(20.84,44.09) 20.7,43.94 U2.22 ; 22.49,49.61 22.92,50.04 24,50.04 25.58,48.47 U46.10
  Bottom Layer w0.203: v1(24.49,40.59) 24.49,40.98 21.39,44.09 v1(20.84,44.09)
IIC_ADDR: length 3.1
  Top Layer w0.203: U6.15 15.97,11.92 R34.1
KEY1: length 58.1
  Top Layer w0.203: SW2.1 57.54,13.08 56.19,13.08 R18.1 ; 55.83,12.83 55.21,12.83 C34.2 54.1,13.68 54.1,13.13 51.77,10.79 30.73,10.79 20.24,21.28 20.24,28.16 15.88,32.53 15.88,32.9 15.74,33.03 U2.12
KEY2: length 58.4
  Top Layer w0.203: SW2.T 57.62,10.62 R19.1 54.75,10.62 C35.2 54.19,11.18 52.83,11.18 52.15,10.49 30.61,10.49 19.94,21.16 19.94,28.04 16.45,31.53 14.85,31.53 14.47,31.91 U2.11
KEY3: length 58.5
  Top Layer w0.203: R20.1 55.75,8.46 ; 55.75,8.46 54.24,8.46 C36.2 54.23,8.46 54.03,8.26 53.17,8.26 51.25,10.19 30.48,10.19 19.16,21.5 19.16,23.38 v1(19.11,23.43) ; 55.75,8.46 55.75,8.38 55.9,8.24 57.78,8.24 SW2.2 ; v1(19.69,33.53) 19.69,34.93 U2.15
  Bottom Layer w0.203: v1(19.69,33.53) 19.69,24 v1(19.11,23.43)
KEY4: length 46.1
  Top Layer w0.203: SW9.2 41.91,6.12 41.91,6.68 41.59,7 41.59,7.26 39.27,9.58 30.23,9.58 18.18,21.63 18.18,24.15 18.08,24.25 18.08,27.34 18.04,27.38 18.04,29.33 16.15,31.23 14.62,31.23 13.2,32.64 U2.10
MIC1N: length 92.1
  Top Layer w0.203: 43.39,11.41 45.92,11.41 MIC1.2 MIC1.3 ; 43.39,11.41 43.41,11.43 43.81,11.43 43.96,11.57 43.96,11.85 R52.2 ; 43.39,11.41 42.61,11.41 42.6,11.43 41.02,11.43 40.61,11.84 40.61,13.97 41.56,14.93 51.89,14.93 55.68,18.72 60.07,18.72 60.16,18.81 60.16,37.83 50,37.83 48.99,38.84 48.99,43.03 48.65,43.37 36.77,43.37 33.91,40.51 27.94,40.51 27.21,41.24 26.77,41.24 26.62,41.39 26.62,42.16 26.67,42.21 26.67,42.22 27.14,42.7 C61.1
MIC1P: length 79
  Top Layer w0.203: 44.2,13.67 44.2,13.67 MIC1.1 ; 44.2,13.67 C100.2 ; 44.2,13.67 44.2,14.35 44.34,14.49 51.89,14.49 55.68,18.29 60.07,18.29 60.47,18.69 60.47,37.92 ; C58.1 28.41,41.31 28.91,40.82 33.53,40.82 36.39,43.68 49.02,43.68 49.4,43.29 49.4,38.86 49.88,38.39 60.04,38.39 60.45,37.97
MIC2N: length 87.4
  Top Layer w0.203: C95.1 35.27,50.77 v1(35.31,50.8) ; v1(2.67,26.36) 2.67,14.35 4.19,12.83 4.19,10.29 4.11,10.21 4.11,10.17 3.96,10.02 3.93,10.02 3.68,9.78 3.68,9 MIC2.3 MIC2.2 3.64,6.29 3.44,6.1
  Bottom Layer w0.203: v1(2.67,26.36) 2.67,48.08 9.32,54.74 22.48,54.74 23.28,55.54 23.28,57.06 24.02,57.8 27.5,57.8 28.33,56.97 28.33,54.57 29.07,53.83 34.31,53.83 35.85,52.29 35.85,50.96 35.69,50.8 v1(35.31,50.8)
MIC2P: length 91.2
  Top Layer w0.203: C96.1 34.61,49.4 v1(35.56,49.4) ; v1(0.99,8) 1.25,8 1.5,7.76 ; MIC2.1 1.5,7.76 ; 1.5,7.76 1.5,6.12
  Bottom Layer w0.203: v1(0.99,8) 0.99,12.29 1.78,13.08 v1(1.78,26.67) 1.78,48.77 8.29,55.28 22.3,55.28 22.95,55.93 22.95,56.09 22.97,56.12 22.97,57.44 23.95,58.42 24.23,58.42 24.41,58.24 27.75,58.24 28.64,57.35 28.64,55.04 29.28,54.39 34.43,54.39 36.16,52.67 36.16,49.66 36.01,49.51 35.67,49.51 v1(35.56,49.4)
MIC3N: length 35.8
  Top Layer w0.203: v1(22.45,34.42) 22.45,42.84 21.84,43.45 21.84,44.41 21.95,44.51 21.95,45.03 C86.1 ; C78.2 43.94,32.73 43.35,32.14 34.17,32.14 33.02,30.99 29.67,30.99 v1(29.46,31.19) 29.46,31.78
  Bottom Layer w0.203: v1(22.45,34.42) 22.45,34.31 25.58,31.19 v1(29.46,31.19)
MIC3P: length 40.6
  Top Layer w0.203: C15.2 41.91,32.72 42.25,33.06 42.25,33.37 42.24,33.37 42.24,33.84 42.25,33.84 42.25,33.91 42.42,34.09 42.42,34.16 42.56,34.31 44.05,34.31 44.53,33.83 44.53,32.34 44.03,31.84 34.3,31.84 33.1,30.63 26.01,30.63 25.87,30.78 25.87,31.69 C108.1 24.62,31.78 23.08,33.31 23.08,43.33 C85.1
PWM0: length 26.5
  Top Layer w0.203: v1(39.06,28.57) 39.37,28.26 R5.1 ; U2.17 20.57,37.59 20.9,37.26 v1(20.9,34.52)
  Bottom Layer w0.203: v1(39.06,28.57) 39.06,28.7 38.68,29.08 25.72,29.08 20.9,33.9 v1(20.9,34.52)
RES: length 7.2
  Top Layer w0.203: 19.18,11.51 18.62,12.06 17.15,12.06 17.15,11.18 16.76,10.79 16.76,9.24 U6.14 ; 21.1,11.87 19.24,11.87
RS232_RX: length 5.8
  Top Layer w0.203: U44.3 51.67,45.88 49.91,47.64 49.91,49.02 49.28,49.66 U5.13
RS232_TX: length 4.4
  Top Layer w0.203: U5.14 49.4,50.93 51.67,48.66 U44.2
RX0: length 65.7
  Top Layer w0.203: 6.85,52.45 U2.36 6.86,50.79 6.85,52.45 ; 6.85,52.45 6.85,56.9 6.71,57.04 5.68,57.04 U48.2 ; v1(46.61,48.39) U5.12
  Bottom Layer w0.203: v1(46.61,48.39) 46.61,55.72 46.95,56.06 46.95,57.19 45.53,58.61 45.26,58.61 44.62,59.25 44.62,59.52 44.28,59.86 44.28,60.17 43.62,60.83 7.24,60.83 6.88,60.48 v1(6.88,56.9)
SCL_0: length 64.5
  Top Layer w0.203: 13.4,11.94 13.9,11.94 R31.2 ; 13.4,11.87 13.28,11.74 13.28,11.23 13.74,10.77 13.74,9.27 U6.18 ; H1.4 H2.4 14.81,54.94 11.76,54.94 9.4,52.58 9.4,50.79 U2.34 9.4,50.78 v1(9.4,49.02)
  Bottom Layer w0.203: v1(13.26,11.94) 13.08,11.94 12.13,12.88 11.16,12.88 5.49,18.55 5.49,27.91 4.11,29.29 4.11,46.66 5.97,48.51 8.89,48.51 v1(9.4,49.02)
SCL_1: length 58.1
  Top Layer w0.203: v1(11.81,49.02) 11.81,50.66 U2.32 11.93,52.45 13.82,54.33 19.94,54.33 20.59,54.98 25.52,54.98 H6.4 26.97,56.43 H7.4 ; v2(29.1,51.03) 28.98,51.03 28.61,50.66 U46.4 ; v1(30.73,37.85) 30.88,37.7 30.88,37.35 30.73,37.21 30.2,37.21 30.05,37.35
  Bottom Layer w0.203: v2(29.1,51.03) 29.1,52.94 26.92,55.12 H6.4 ; v1(11.81,49.02) 11.81,46.23 15.49,42.54 21.08,42.54 25.42,38.2 30.25,38.2 30.61,37.85 v1(30.73,37.85)
SCL_2: length 27.7
  Top Layer w0.203: H8.4 37.68,56.47 H9.4 37.47,56.39 35.4,54.32 26.15,54.32 25.46,53.63 21,53.63 20.54,53.18 20.54,48.47 19.95,47.88 19.69,47.88 U2.25
SCL_3: length 55.8
  Top Layer w0.203: 48.26,59.58 48.26,59.84 46.65,61.45 4.68,61.45 3.94,60.71 3.94,53.47 3.04,52.58 U2.39
SD_CLK: length 14
  Top Layer w0.203: R82.2 15.4,24.56 CARD2.5 13.19,24.63 9.39,28.43 U2.7
SD_CMD: length 16.1
  Top Layer w0.203: U2.6 8.1,33.26 8.1,29.29 13.89,23.49 13.89,22.96 14.22,22.63 15.13,22.63 CARD2.3 16.65,22.43 R81.2
SD_D0: length 19
  Top Layer w0.203: R83.2 15.48,26.97 15.33,26.83 ; 10.82,32.8 10.8,32.77 10.55,32.77 10.34,32.56 10.34,32.21 10.48,32.07 11.28,32.07 11.43,31.93 11.43,31.71 11.28,31.56 10.48,31.56 10.34,31.42 10.34,31.2 10.48,31.06 11.28,31.06 11.43,30.91 11.43,30.69 11.28,30.55 10.48,30.55 10.34,30.4 10.34,30.18 10.48,30.04 11.28,30.04 11.43,29.9 11.43,29.67 11.28,29.53 10.48,29.53 10.34,29.39 10.34,29.17 10.48,29.02 11.28,29.02 11.43,28.88 11.43,28.66 11.28,28.52 10.48,28.52 10.34,28.37 10.34,28.07 11.55,26.87 14.6,26.87 14.66,26.8 14.71,26.8
SD_D1: length 19.7
  Top Layer w0.203: 15.74,27.86 15.89,27.72 16.24,27.72 16.39,27.86 16.39,28.9 16.71,29.22 16.82,29.22 ; CARD2.8 12.51,27.93 12.31,28.13 12.31,28.5 12.44,28.64 13.11,28.64 13.28,28.81 13.28,29.03 13.14,29.18 12.08,29.18 11.93,29.32 11.93,29.54 12.08,29.68 13.14,29.68 13.28,29.83 13.28,30.05 13.14,30.19 12.08,30.19 11.93,30.33 11.93,30.56 12.08,30.7 13.14,30.7 13.28,30.84 13.28,31.06 13.14,31.21 12.08,31.21 11.93,31.35 11.93,31.57 12.08,31.72 13.14,31.72 13.28,31.86 13.28,32.08 13.14,32.22 12.08,32.22 11.93,32.37 U2.9
SD_D2: length 21.1
  Top Layer w0.203: R79.2 16.59,17.32 15.49,18.41 15.49,20.07 CARD2.1 14.92,20.23 6.09,29.07 6.09,30.93 5.88,31.14 5.88,32.99 U2.4
SD_D3: length 19.9
  Top Layer w0.203: R80.2 16.93,19.78 16.39,20.32 16.39,20.68 15.74,21.33 14.95,21.33 14.58,21.7 14.17,21.7 14.03,21.85 14.03,22.26 10.72,25.56 10.72,25.76 10.86,25.9 10.86,26.1 10.7,26.26 10.5,26.26 10.36,26.12 10.16,26.12 10,26.28 10,26.48 10.14,26.62 10.14,26.82 9.98,26.97 9.78,26.97 9.64,26.84 9.44,26.84 6.6,29.68 6.6,33.03 U2.5
SDA_0: length 64
  Top Layer w0.203: 12.45,10.95 12.47,10.92 13.06,10.92 13.21,10.78 13.21,9.18 13.17,9.14 ; 12.45,10.95 12.45,9.17 U6.20 ; 12.45,10.95 12.45,12.03 R32.1 11.57,12.19 v1(11.5,12.12) ; H1.3 H2.3 13.86,56.24 13.86,55.77 13.34,55.24 10.92,55.24 8.25,52.58 8.25,50.92 U2.35 8.12,49.17 v1(8.13,49.17)
  Bottom Layer w0.203: v1(8.13,49.17) 6.19,49.17 3.81,46.79 3.81,29.16 5.19,27.78 5.19,18.43 v1(11.5,12.12)
SDA_1: length 70.4
  Top Layer w0.203: U46.3 29.01,50.17 29.15,50.31 29.15,50.32 29.55,50.72 29.56,50.72 v2(29.85,51.01) ; 30.88,36.15 31.75,36.15 ; U2.33 10.8,50.92 10.8,52.45 12.98,54.64 19.81,54.64 20.46,55.28 23.66,55.28 24.38,56.01 H6.3 24.43,56.43 H7.3
  Bottom Layer w0.203: H7.3 25.57,58.55 35.56,58.55 36.49,57.62 36.49,55.93 36.58,55.84 36.58,43.81 33.27,40.51 33.27,37.47 v1(31.95,36.15) ; v2(29.85,51.01) 29.85,51.03 29.72,51.16 29.72,52.75 28.03,54.44 28.03,56.85 27.38,57.49 26.47,57.49 25.36,56.39 H6.3
SDA_2: length 24.4
  Top Layer w0.203: H8.3 35.14,56.47 H9.3 35.05,56.21 33.46,54.62 26.02,54.62 25.77,54.37 20.84,54.37 19.53,53.06 U2.26
SDA_3: length 52.2
  Top Layer w0.203: 45.72,59.58 45.72,60.09 44.67,61.14 5.26,61.14 4.44,60.32 4.44,58.56 4.43,58.55 4.43,57.74 4.44,57.73 4.44,57.31 4.43,57.3 4.43,56.49 4.44,56.48 4.44,56.06 4.43,56.05 4.43,55.24 4.44,55.23 4.44,50.91 U2.38
TX0: length 71.6
  Top Layer w0.203: U48.3 v1(5.54,54.84) 5.54,50.83 U2.37 5.59,50.79 5.59,52.32 ; v1(49.84,46.61) 49.33,47.12 U5.11
  Bottom Layer w0.203: v1(5.54,54.84) 4.73,54.84 4.44,55.12 4.44,58.47 7.11,61.14 46.18,61.14 47.16,60.16 47.16,59.25 50.04,56.37 50.04,46.75 49.89,46.61 v1(49.84,46.61)
WS2812: length 44
  Top Layer w0.203: 45.85,56.51 45.85,57.02 44.32,58.55 44.32,60.58 44.18,60.72 43.73,60.72 43.64,60.81 34.7,60.81 34.61,60.72 34.04,60.72 33.7,60.39 33.7,55.29 33.34,54.93 25.9,54.93 25.64,54.67 20.72,54.67 20.07,54.03 14.78,54.03 13.46,52.7 13.46,51.04 U2.31
$1N23620: length 5
  Top Layer w0.203: R30.2 10.34,12.39 9.84,12.39 9.41,11.97 9.41,11.78 8.99,11.36 8.51,11.36 8.36,11.21 8.36,9.23 U6.26
$1N23621: length 3.7
  Top Layer w0.203: U6.27 7.57,10.96 C49.2
$1N23622: length 3.3
  Top Layer w0.203: C48.2 6.87,11.91 U6.28
$1N23626: length 3.1
  Top Layer w0.203: U6.2 25.07,11.63 C46.2
$1N23627: length 4.4
  Top Layer w0.203: C46.1 24.38,13.03 24.11,12.76 24.11,11.68 24.37,11.42 U6.3
$1N23628: length 4.5
  Top Layer w0.203: U6.5 22.75,9.36 22.75,10.75 22.67,10.83 22.67,11.37 22.46,11.57 22.46,12.81 22.61,12.95 22.89,12.95 C47.1
$1N23629: length 3.2
  Top Layer w0.203: U6.4 23.67,11 22.99,11.68 C47.2
$1N23662: length 9.2
  Top Layer w0.203: 39.75,16.77 36.05,20.47 33.82,20.47 33.36,20.93 33.36,21.68 33.24,21.8 U1.7
$1N23663: length 9.2
  Top Layer w0.203: U1.5 35.56,21.71 35.56,21.08 35.42,20.94 33.96,20.94 33.84,21.06 33.84,26.98 34.04,27.18 34.23,27.18
$1N23665: length 6.8
  Top Layer w0.203: 39.12,24.69 38.99,24.82 38.66,24.82 38.15,24.3 35.34,24.3 34.54,23.51 34.54,22.09 34.51,22.05 U1.6
$1N23671: length 14.8
  Top Layer w0.203: v1(31.12,16) 31.12,16.52 31.56,16.96 32.37,16.96 33.22,16.11 U1.2
  Bottom Layer w0.203: v1(31.12,16) 31.12,14.99 32.77,13.33 32.77,8.76 33.46,8.07 D25.2 36,8.07 D50.1
$1N23672: length 24.9
  Top Layer w0.203: U1.3 33.35,17.27 30.99,17.27 28.7,14.99 v1(28.6,14.99)
  Bottom Layer w0.203: D100.1 39.9,8.07 D75.2 38.06,7.45 37.72,7.11 32.89,7.11 31.62,8.38 31.62,11.97 v1(28.6,14.99)
$1N23673: length 13.4
  Top Layer w0.203: U1.4 35.78,16.11 v1(36.84,16.11)
  Bottom Layer w0.203: 36.96,9.78 36.97,9.79 36.97,12.3 36.97,12.31 36.97,12.77 36.97,12.77 36.97,15.99 v1(36.84,16.11) ; 36.96,9.78 37.95,9.78 38.06,9.67 39.9,9.67 D100.2 ; 36.96,9.78 36.12,9.78 D50.2 34.27,9.77 34.17,9.67
$1N23676: length 1.9
  Top Layer w0.203: 33.83,13.68 31.98,13.68 C7.2
$1N23677: length 1.6
  Top Layer w0.203: R5.2 37.82,26.62 37.81,26.61
$1N23678: length 54.3
  Top Layer w0.203: R2.2 34.11,28.07 35.05,28.07 35.55,27.57 v1(35.55,26.93) ; SW11.4 56.04,3.82 55.5,3.82 v1(53.9,5.42)
  Bottom Layer w0.203: v1(53.9,5.42) 53.76,5.28 34.21,5.28 27.57,11.93 27.57,16.78 31.24,20.45 32.26,20.45 33.04,21.23 33.04,21.99 33.91,22.86 33.91,26.02 34.05,26.16 35.42,26.16 35.81,26.55 35.81,26.68 v1(35.55,26.93)
$1N23741: length 2.9
  Top Layer w0.203: USB1.4 57.79,22.87 57.16,22.87 55.63,21.34 R76.1
$1N23744: length 2.5
  Top Layer w0.203: USB1.10 56.65,25.9 55.93,26.63 55.72,26.63 R75.1
$1N23765: length 2.5
  Top Layer w0.203: Q5.3 43.91,29.84 43.75,30 BUZZER1.2
$1N23776: length 10.2
  Top Layer w0.203: U5.1 39.62,53.47 38.61,52.45 38.61,49.42 38.89,49.13 40.09,49.13 40.61,49.66 C51.2
$1N23777: length 4.3
  Top Layer w0.203: C51.1 39.48,49.76 39.48,50.15 39.62,50.29 42.32,50.29 U5.3
$1N23778: length 3.9
  Top Layer w0.152: U5.4 41.78,49.66 40.96,48.83 40.19,48.83 39.69,48.33 C113.1
$1N23779: length 10
  Top Layer w0.203: U5.2 43.94,52.2 44.45,51.69 44.45,48.64 44.2,48.39 U5.5 42.9,48.33 C113.2 C114.2
$1N23789: length 2.9
  Top Layer w0.203: C115.2 42.25,47.12 U5.6
$1N27324: length 3.6
  Top Layer w0.203: C67.2 41.89,7.77 41.89,7.13 42.04,6.98 43.05,6.98 43.5,6.54 SW7.1
$1N27440: length 2.4
  Top Layer w0.203: 28.66,7.87 28.9,7.64 SW8.1
$1N27527: length 4.1
  Top Layer w0.203: 36.5,6.17 36.26,5.93 36.13,5.93 ; 36.5,6.17 36.5,6.32 36.64,6.46 37.96,6.46 38.1,6.6 38.1,7.84 38.06,7.87 C69.2 ; 36.5,6.17 36.5,5.79
$1N35832: length 1.5
  Top Layer w0.203: C78.1 43.88,33.67 43.87,33.67 43.02,32.82 42.86,32.82 R8.1
$1N35833: length 1.7
  Bottom Layer w0.203: v1(42.8,33.6) 42.8,33.78 41.78,34.8 v1(41.66,34.8)
$1N35834: length 1.2
  Top Layer w0.203: C15.1 41.45,33.57 40.77,32.89
$1N35835: length 2.1
  Top Layer w0.203: 40.64,33.57 40.97,33.9 40.97,35.57
$1N35838: length 2
  Top Layer w0.203: 39.5,33.88 40.26,34.64 ; 40.26,34.64 40.26,34.52 ; 40.26,34.64 40.26,35.39 U3.2
$1N35849: length 14.6
  Top Layer w0.203: 44.57,39.61 42.77,39.61 41.8,38.64 39.97,38.64 39.62,38.99 39.62,39.62 ; 37.08,33.57 37.08,39.01 37.82,39.75 39.5,39.75 39.62,39.62 ; 39.62,39.62 39.62,39.7 39.66,39.74
$1N35850: length 9.3
  Top Layer w0.203: U3.5 41.51,39.84 41.51,40.75 41.66,40.89 42.34,40.89 C21.2 44.49,41.87 45.59,40.77 45.59,38.69 45.26,38.36 44.57,38.36
$1N39161: length 11.2
  Top Layer w0.203: U46.1 30.16,49.59 30.99,50.42 32.38,50.42 34.04,52.07 34.04,52.96 33.64,53.36 33.64,53.36 33.41,53.6 31.34,53.6 30.97,53.23 30.97,52.24 30.84,52.11 R26.1
$1N39162: length 5.1
  Top Layer w0.203: R27.1 33.11,51.98 31.85,50.72 30.49,50.72 30.19,50.42 29.68,50.42 29.45,50.19 29.45,49.64 U46.2
$1N39181: length 3.8
  Top Layer w0.203: U46.16 25.49,46.07 23.46,44.03 C85.2
$1N39182: length 3.4
  Top Layer w0.203: C86.2 24.38,45.47 25.4,46.48 26.26,46.48 U46.15
$1N39187: length 3.7
  Top Layer w0.203: C59.1 24.96,42.74 27.01,44.78 U46.17
$1N39188: length 3.1
  Top Layer w0.203: U46.18 27.4,45.2 27.4,44.26 C60.1
$1N39190: length 3.7
  Top Layer w0.203: C61.2 27.63,42.26 27.65,42.26 27.8,42.4 27.8,45.2 U46.19
$1N39191: length 2.6
  Top Layer w0.203: U46.20 28.19,45.2 28.19,43.43 28.41,43.21 C58.2
$1N39202: length 4.4
  Top Layer w0.203: C41.1 31.62,43.41 31.62,45.72 31.28,46.07 U46.25
$1N39203: length 4.9
  Top Layer w0.203: U46.26 31.44,46.47 32.22,45.69 C40.1
$1N39205: length 4.9
  Top Layer w0.203: C39.1 33.4,43.96 32.53,44.83 32.53,45.96 31.62,46.87 U46.27
$1N39206: length 3.9
  Top Layer w0.203: U46.28 31.75,47.27 C37.1
$1N39207: length 3.4
  Top Layer w0.203: U46.29 31.84,47.67 32.78,46.72 C90.1
$1N39208: length 3.1
  Top Layer w0.203: C89.1 33.63,48.07 U46.30
$1N39216: length 3.2
  Top Layer w0.203: U46.12 25.57,47.67 24.38,46.48 23.67,46.48 23.61,46.55
$1N39217: length 3.1
  Top Layer w0.203: 23.26,48.23 23.42,48.07 U46.11
$1N41396: length 3.8
  Top Layer w0.203: U46.32 31.75,48.87 C95.2
$1N41441: length 3.4
  Top Layer w0.203: U46.31 32.71,48.47 C96.2
$1N51216: length 4.6
  Top Layer w0.203: 27.08,33.28 27.05,33.25 C106.2 ; 27.08,33.28 26.55,33.28 26.55,33.27 26.19,33.27 25.78,32.87 C108.2 ; 27.08,33.28 27.3,33.28 27.3,33.27 27.94,33.27 27.95,33.28 28.62,33.28 28.82,33.48 28.82,34.07 U9.12
$1N51217: length 2.9
  Top Layer w0.203: 29.25,34.25 29.26,34.24 29.26,33.48 29.46,33.27 29.46,32.74 ; 29.46,32.74 C109.2 ; 29.46,32.74 C107.2
$1N51225: length 2.6
  Top Layer w0.203: 30.05,34.1 30.77,34.1 C44.2
$1N51226: length 2.3
  Top Layer w0.203: 29.65,34.25 29.7,34.2 29.7,33.49 29.85,33.34 30.26,33.34 C45.2
$1N51228: length 5.9
  Top Layer w0.203: 32.19,38.82 32.49,38.82 32.58,38.73 32.58,35.24 32.28,34.95 30.75,34.95

## Copper pours and planes (outline as drawn; the poured copper is in the pictures)
GND on Top Layer: -2.67,64.13 68.71,64.13 69.6,63.25 69.6,1.14 68.33,-0.13 -2.03,-0.13 -2.67,0.51
GND on Bottom Layer: -3.56,64.64 66.68,64.64 66.68,1.65 -3.56,1.65
GND on 电源层: -1.65,64.39 67.06,64.39 67.06,2.54 -1.65,2.54
AU_GND on 地层: -1.65,62.36 64.52,62.36 64.52,1.91 -1.65,1.91

Small or netless copper shapes (teardrops, artwork), in the pictures only: 487 on Top Layer, 62 on Bottom Layer, 34 on 电源层, 16 on 地层

## Text on the board
Bottom Silkscreen Layer: RESET | KEY4 | BOOT | ON/OFF | CARD | USB | RS232 | 3V3 | GND | SDA_0 | SCL_0 | SDA_1 | SCL_1 | SDA_2 | SCL_2 | 5V | WS2812 | SDA_3 | SCL_3 | 工程 | CUSTOM / CONTROL / V2.0.0 YJY
Top Silkscreen Layer: RX | TX | GND
